# Altium schematic sheet Sheet1.SchDoc
size A4
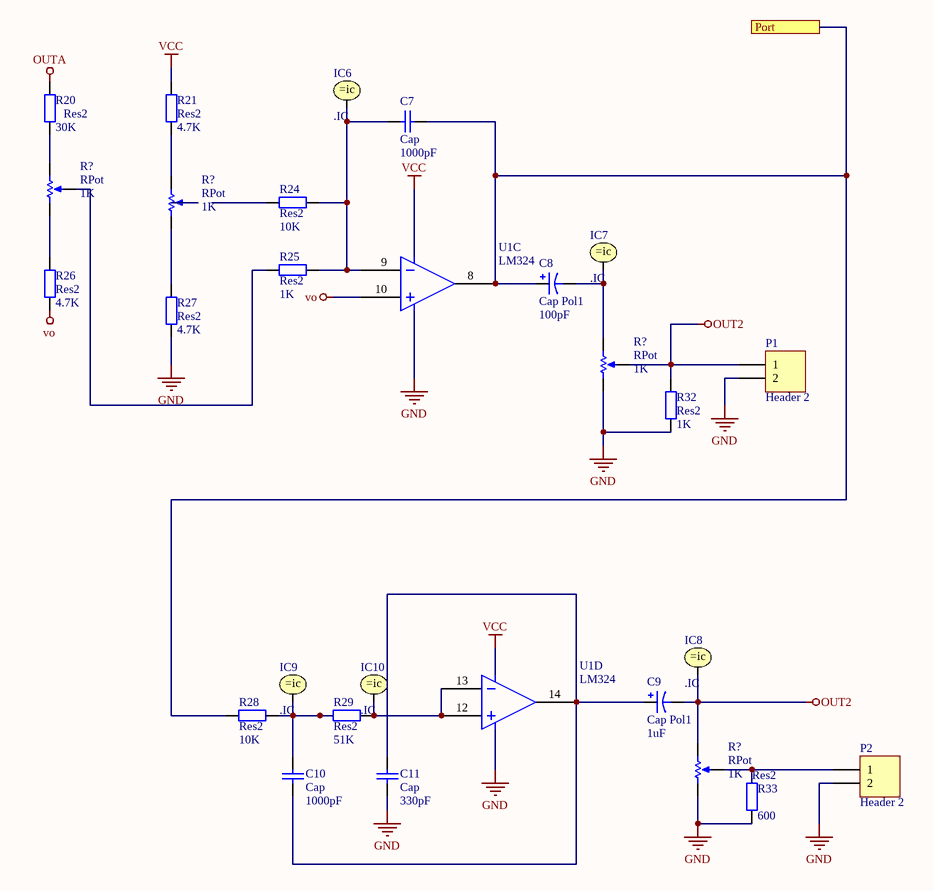
[diagram p0: Sheet1.SchDoc]

## Parts
(Parts that share a designator on the sheet are numbered #1, #2 ... from top to bottom, then left to right.)
C7  Cap  value 1000pF  [RAD-0.3]
C8  Cap Pol1  value 100pF  [RB7.6-15]
C9  Cap Pol1  value 1uF  [RB7.6-15]
C10  Cap  value 1000pF  [RAD-0.3]
C11  Cap  value 330pF  [RAD-0.3]
IC6  .IC
IC7  .IC
IC8  .IC
IC9  .IC
IC10  .IC
P1  Header 2  [HDR1X2]
P2  Header 2  [HDR1X2]
R20  Res2  value 30K  [AXIAL-0.4]
R21  Res2  value 4.7K  [AXIAL-0.4]
R24  Res2  value 10K  [AXIAL-0.4]
R25  Res2  value 1K  [AXIAL-0.4]
R26  Res2  value 4.7K  [AXIAL-0.4]
R27  Res2  value 4.7K  [AXIAL-0.4]
R28  Res2  value 10K  [AXIAL-0.4]
R29  Res2  value 51K  [AXIAL-0.4]
R32  Res2  value 1K  [AXIAL-0.4]
R33  Res2  value 600  [AXIAL-0.4]
R?#1  RPot  value 1K  [VR5]
R?#2  RPot  value 1K  [VR5]
R?#3  RPot  value 1K  [VR5]
R?#4  RPot  value 1K  [VR5]
U1  LM324  [DIP-14]  (parts C,D of 4)

## Ports
Port

## Nets
GND: C11.1 P1.2 P2.2 R27.1 R32.2 R33.2 R?#3.1(TOP) R?#4.1(TOP)
OUT2: C9.2 IC8.1 P1.1 R32.1 R?#3.3(TAP) R?#4.2(BOT)
OUTA: R20.2
VCC: R21.2
vo: R26.1 U1.10
Port: C7.2 C8.1 R28.1 U1.8 ; port Port
NetC7_1: C7.1 IC6.1 R24.2 R25.2 U1.9
NetC8_2: C8.2 IC7.1 R?#3.2(BOT)
NetC9_1: C9.1 C10.1 C11.2 U1.14
NetC10_2: C10.2 IC9.1 R28.2 R29.1
NetIC10_1: IC10.1 R29.2 U1.12 U1.13
NetP2_1: P2.1 R33.1 R?#4.3(TAP)
NetR20_1: R20.1 R?#1.2(BOT)
NetR21_1: R21.1 R?#2.2(BOT)
NetR25_1: R25.1 R?#1.3(TAP)
NetR26_2: R26.2 R?#1.1(TOP)
NetR27_2: R27.2 R?#2.1(TOP)

Not connected (* = marked no-connect by the designer): R24 1; R?#2 3(TAP)

## Library data of the parts
C7 C10 C11 = Cap: Capacitor; Published: 8-Jun-2000; LatestRevisionDate: 17-Jul-2002; LatestRevisionNote: Re-released for DXP Platform.; PackageReference: RAD-0.3; Publisher: Altium Limited; PackageDescription: Radial Cap, Thru-Hole; 2 Leads; 0.3 in Pin Spacing
C8 C9 = Cap Pol1: Polarized Capacitor (Radial); Published: 8-Jun-2000; LatestRevisionDate: 17-Jul-2002; LatestRevisionNote: Re-released for DXP Platform.; PackageReference: RB7.6-15; Publisher: Altium Limited; PackageDescription: Polarized Capacitor (Radial); 2 Leads
IC6-IC10 = .IC: Initial Condition; Published: 8-Jun-2000; LatestRevisionDate: 17-Jul-2002; LatestRevisionNote: Re-released for DXP Platform.; PackageReference: Not Applicable; Publisher: Altium Limited
P1 P2 = Header 2: Header, 2-Pin; LatestRevisionDate: 17-Jul-2002; LatestRevisionNote: Re-released for DXP Platform.; Publisher: Altium Limited
R20 R21 R24-R29 R32 R33 = Res2: Resistor; Published: 8-Jun-2000; LatestRevisionDate: 17-Jul-2002; LatestRevisionNote: Re-released for DXP Platform.; PackageReference: AXIAL-0.4; Publisher: Altium Limited; PackageDescription: Axial Device, Thru-Hole; 2 Leads; 0.4 in Pin Spacing
R?#1-R?#4 = RPot: Potentiometer; Sim Note: Enter the Resistance value and the set point into parameter fields.; Set Position: 0.5; Published: 8-Jun-2000; LatestRevisionDate: 17-Jul-2002; LatestRevisionNote: Re-released for DXP Platform.; PackageReference: VR5; Publisher: Altium Limited; PackageDescription: Variable Resistor, Thru-Hole; 3 Leads